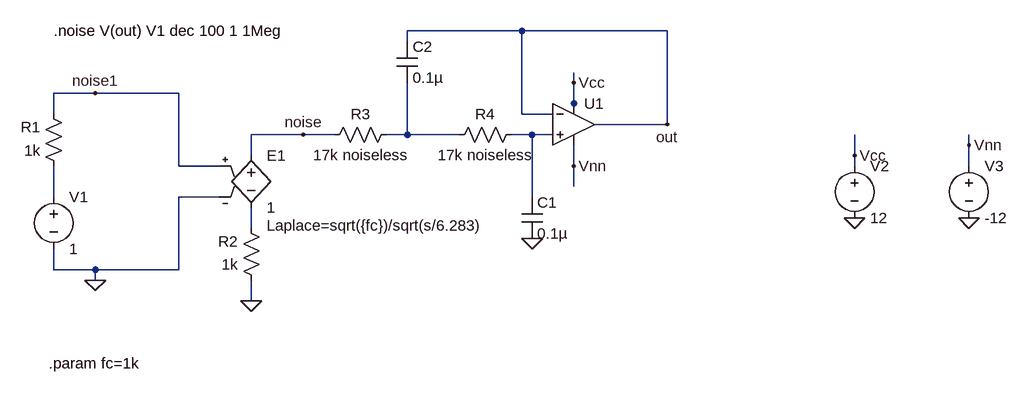
[diagram p0: schematic homework-1-e.asc]
homework-1-e.asc, the LTspice schematic file:
Version 4
SHEET 1 1620 680
WIRE 864 -32 688 -32
WIRE 1088 -32 864 -32
WIRE 688 -16 688 -32
WIRE 944 48 944 32
WIRE 208 64 144 64
WIRE 336 64 208 64
WIRE 944 80 944 48
WIRE 144 96 144 64
WIRE 864 96 864 -32
WIRE 912 96 864 96
WIRE 944 96 944 80
WIRE 1088 112 1088 -32
WIRE 1088 112 976 112
WIRE 528 128 448 128
WIRE 576 128 528 128
WIRE 688 128 688 48
WIRE 688 128 656 128
WIRE 768 128 688 128
WIRE 880 128 848 128
WIRE 912 128 880 128
WIRE 1552 144 1552 128
WIRE 448 160 448 128
WIRE 1376 160 1376 128
WIRE 336 176 336 64
WIRE 400 176 336 176
WIRE 944 176 944 144
WIRE 1376 176 1376 160
WIRE 1552 176 1552 144
WIRE 944 208 944 176
WIRE 144 224 144 176
WIRE 400 224 336 224
WIRE 880 224 880 128
WIRE 448 272 448 240
WIRE 144 336 144 304
WIRE 208 336 144 336
WIRE 336 336 336 224
WIRE 336 336 208 336
WIRE 208 352 208 336
WIRE 448 384 448 352
FLAG 208 352 0
FLAG 208 64 noise1
FLAG 528 128 noise
FLAG 448 384 0
FLAG 880 288 0
FLAG 1376 256 0
FLAG 1552 256 0
FLAG 944 176 Vnn
FLAG 944 48 Vcc
FLAG 1376 160 Vcc
FLAG 1552 144 Vnn
FLAG 1088 112 out
SYMBOL res 160 192 R180
WINDOW 0 36 76 Left 2
WINDOW 3 36 40 Left 2
SYMATTR InstName R1
SYMATTR Value 1k
SYMBOL e 448 144 R0
WINDOW 123 24 124 Left 2
SYMATTR Value2 Laplace=sqrt({fc})/sqrt(s/6.283)
SYMATTR InstName E1
SYMATTR Value 1
SYMBOL voltage 144 208 R0
WINDOW 123 0 0 Left 0
WINDOW 39 0 0 Left 0
SYMATTR InstName V1
SYMATTR Value 1
SYMBOL res 464 368 R180
WINDOW 0 36 76 Left 2
WINDOW 3 36 40 Left 2
SYMATTR InstName R2
SYMATTR Value 1k
SYMBOL OpAmps\\UniversalOpamp2 944 112 R0
SYMATTR InstName U1
SYMBOL res 672 112 R90
WINDOW 0 0 56 VBottom 2
WINDOW 3 32 56 VTop 2
SYMATTR InstName R3
SYMATTR Value 17k noiseless
SYMBOL res 864 112 R90
WINDOW 0 0 56 VBottom 2
WINDOW 3 32 56 VTop 2
SYMATTR InstName R4
SYMATTR Value 17k noiseless
SYMBOL cap 864 224 R0
SYMATTR InstName C1
SYMATTR Value 0.1µ
SYMBOL cap 672 -16 R0
SYMATTR InstName C2
SYMATTR Value 0.1µ
SYMBOL voltage 1376 160 R0
WINDOW 123 0 0 Left 0
WINDOW 39 0 0 Left 0
SYMATTR InstName V2
SYMATTR Value 12
SYMBOL voltage 1552 160 R0
WINDOW 123 0 0 Left 0
WINDOW 39 0 0 Left 0
SYMATTR InstName V3
SYMATTR Value -12
TEXT 144 -32 Left 2 !.noise V(out) V1 dec 100 1 1Meg
TEXT 136 480 Left 2 !.param fc=1k

The netlist it stands for:
* homework-1-e.asc
R1 N003 noise1 1k
E1 noise N004 noise1 0 1 Laplace=sqrt({fc})/sqrt(s/6.283)
V1 N003 0 1
R2 0 N004 1k
XU1 N002 out Vcc Vnn out level.2 Avol=1Meg GBW=10Meg Slew=10Meg ilimit=25m rail=0 Vos=0 phimargin=45 en=0 enk=0 in=0 ink=0 Rin=500Meg  ; pins IN+ IN- V+ V- OUT
R3 N001 noise 17k noiseless
R4 N002 N001 17k noiseless
C1 N002 0 0.1µ
C2 out N001 0.1µ
V2 Vcc 0 12
V3 Vnn 0 -12
.noise V(out) V1 dec 100 1 1Meg
.param fc=1k
.lib UniversalOpamps2.sub
.backanno
.end